# EasyEDA Pro project bldc_driver_board_easyeda_2.eprj, board PCB4
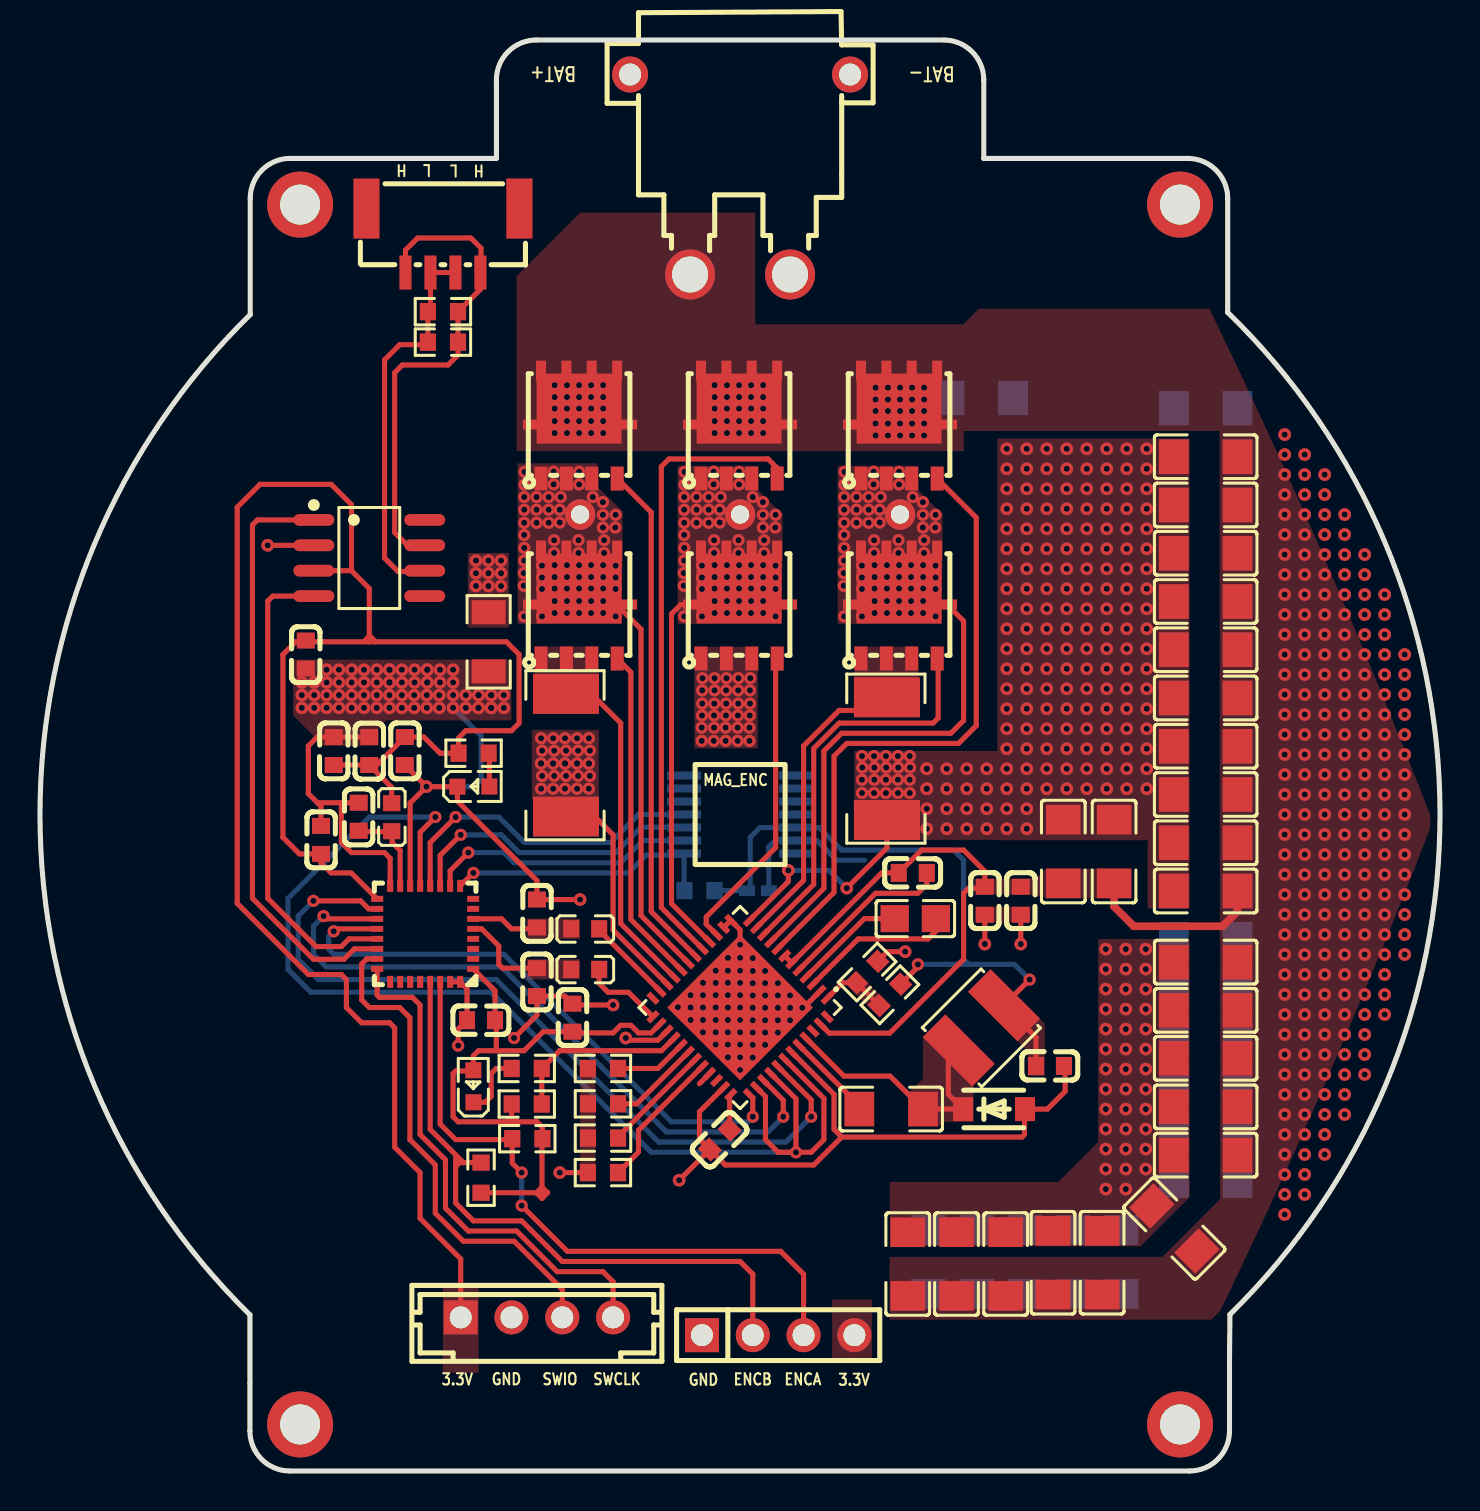
[diagram p1: board, top side]
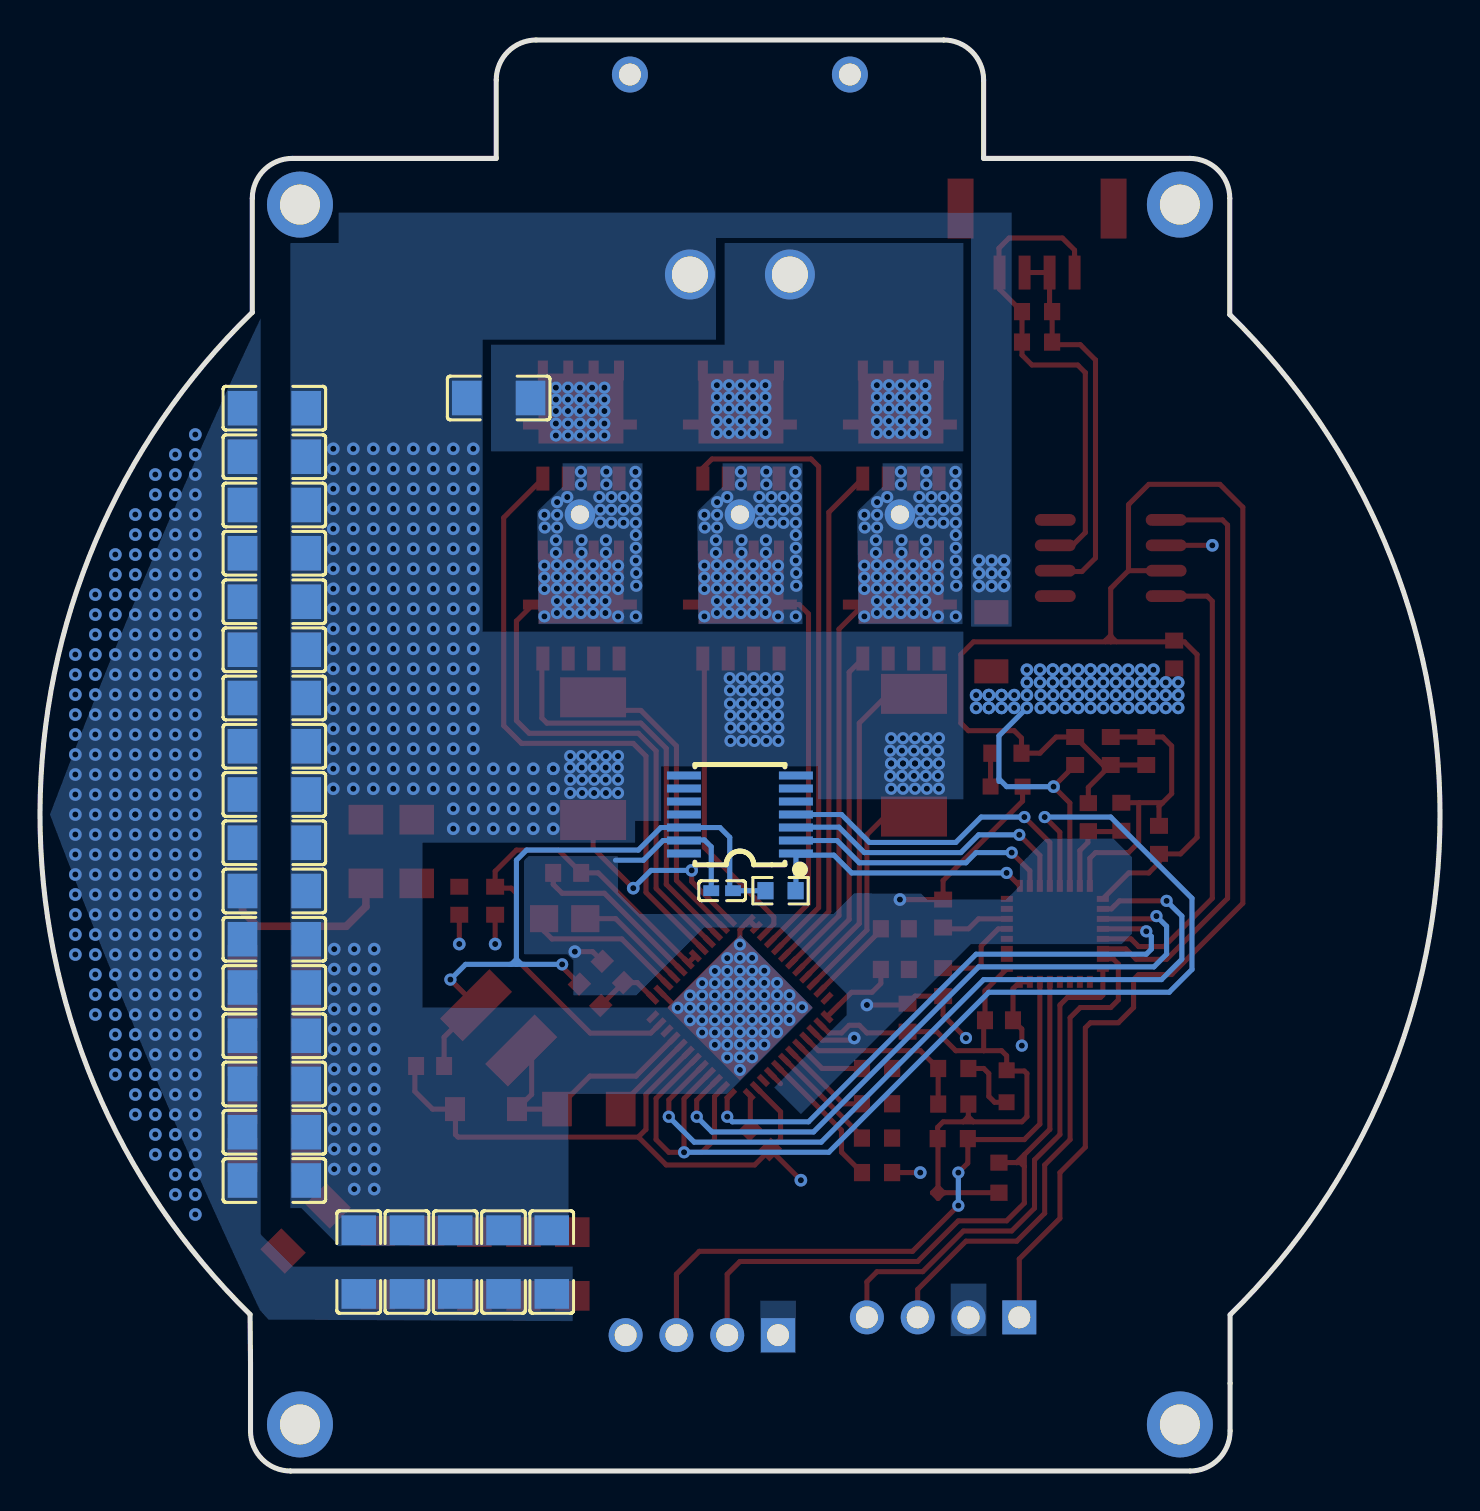
[diagram p2: board, bottom side, seen from below]

Outline 70.01 x 71.56 mm; copper layers: Top Layer, Bottom Layer. Coordinates in mm from the lower left corner of the outline.
Outline path: 10.5,7.81 arc(0,32.82) 10.51,57.83 10.51,63.64 arc(11.1,65.05) 12.51,65.64 22.82,65.64 22.82,69.56 arc(23.41,70.97) 24.82,71.56 45.19,71.56 arc(46.61,70.97) 47.19,69.56 47.19,65.64 57.39,65.64 arc(58.81,65.05) 59.39,63.64 59.39,57.94 arc(70.01,32.91) 59.5,7.83 59.48,5.43 59.48,2 arc(58.9,0.59) 57.48,0 12.5,0 arc(11.08,0.59) 10.5,2 10.5,7.81
Stack: Top Layer 0.035mm / Dielectric1 1.51mm FR4 er 4.5 / Bottom Layer 0.035mm

## Design rules (mm)
template: JLCPCB Capability(Two Layers Board)
spacing copperThickness1oz (default): track to track 0.102, other pairs 0.152 to 0.3
spacing copperThickness2oz: track to track 0.203, other pairs 0.152 to 0.3
track width copperThickness1oz (default): min 0.127, default 0.254, max 2.54
track width copperThickness2oz: min 0.203, default 0.254, max 2.54
differential pair differentialPair (default): width min 0.127, default 0.254, max 2.54; gap min 0.152, default 0.152
via viaSize (default): diameter min 0.5, default 0.61, max 10; hole min 0.3, default 0.305, max 6.3

## Placement (name value [footprint] x y rotation side)
C1  100nF  [C0603]  22.05 22.54 0 top
C2  100nF  [C0603]  14.05 31.56 270 top
C5  47nF  [C0805]  43.77 27.62 0 top
C6  10uF  [C1206]  53.71 30.98 90 top
C7  100nF  [C1206]  51.17 30.98 90 top
C8  1uF  [C0603]  43.64 29.91 0 top
C9  100nF  [C0603]  26.63 22.67 270 top
C10  1uF  [C0603]  33.99 16.57 45 top
C11  100nF  [C1206]  42.56 18.1 180 top
C12  22uF  [C0603]  50.5 20.26 0 top
C13  1uF  [C0603]  47.25 28.52 270 top
C14  1uF  [C0603]  49.04 28.52 270 top
C15  10uF  [C1206]  56.72 12.13 315 top
C16  10uF  [C1206]  58.29 48.31 0 bottom
C17  10uF  [C1206]  47.07 53.66 180 bottom
C18  10uF  [C1206]  46.83 10.45 270 bottom
C19  10uF  [C1206]  51.66 10.45 270 bottom
C20  10uF  [C1206]  43.39 10.35 270 top
C21  10uF  [C1206]  58.29 18.21 0 top
C22  10uF  [C1206]  58.29 50.72 0 top
C23  10uF  [C1206]  58.29 19.35 0 bottom
C24  10uF  [C1206]  58.29 21.77 0 bottom
C25  10uF  [C1206]  58.29 29 0 bottom
C26  10uF  [C1206]  58.29 31.42 0 bottom
C27  10uF  [C1206]  58.29 36.24 0 bottom
C28  10uF  [C1206]  58.29 41.07 0 bottom
C29  10uF  [C1206]  58.29 48.31 0 top
C30  10uF  [C1206]  58.29 43.48 0 top
C31  10uF  [C1206]  58.29 38.66 0 top
C32  10uF  [C1206]  58.29 33.83 0 top
C33  10uF  [C1206]  58.29 29 0 top
C34  10uF  [C1206]  58.29 23.04 0 top
C35  10uF  [C1206]  58.29 45.9 0 bottom
C36  10uF  [C1206]  58.29 50.72 0 bottom
C37  10uF  [C1206]  44.42 10.45 270 bottom
C38  10uF  [C1206]  49.24 10.45 270 bottom
C39  10uF  [C1206]  54.07 10.45 270 bottom
C40  10uF  [C1206]  58.29 53.15 0 bottom
C41  10uF  [C1206]  58.29 15.8 0 top
C42  10uF  [C1206]  58.29 14.53 0 bottom
C43  10uF  [C1206]  58.29 16.94 0 bottom
C44  10uF  [C1206]  58.29 24.18 0 bottom
C45  10uF  [C1206]  58.29 26.59 0 bottom
C46  10uF  [C1206]  58.29 33.83 0 bottom
C47  10uF  [C1206]  58.29 38.66 0 bottom
C48  10uF  [C1206]  58.29 43.47 0 bottom
C49  10uF  [C1206]  58.29 45.9 0 top
C50  10uF  [C1206]  58.29 41.07 0 top
C51  10uF  [C1206]  58.29 36.24 0 top
C52  10uF  [C1206]  58.29 31.42 0 top
C53  10uF  [C1206]  58.29 25.45 0 top
C54  10uF  [C1206]  58.29 20.64 0 top
C55  22uF  [C0603]  13.29 40.83 90 top
C56  220nF  [C0603]  14.69 36 270 top
C57  10nF  [C0603]  24.85 24.45 270 top
C58  10nF  [C0603]  24.85 27.88 270 top
C59  2.2uF  [C0402]  35.9 29.02 180 bottom
C60  10uF  [C1206]  48.29 10.35 270 top
C61  10uF  [C1206]  45.83 10.35 270 top
C62  10uF  [C1206]  53.11 10.41 270 top
C63  10uF  [C1206]  50.66 10.41 270 top
CN1  A1257WR-S-4P  [CONN-SMD_A1257WR-S-4P]  20.15 61.53 180 top
CN2  XT30PW-M  [CONN-TH_XT30PW-M]  35.01 64.83 180 top
D1  MBR1H100SFT3G  [SOD-123F_L2.8-W1.8-LS3.7-RD]  47.71 18.1 0 top
H2  PZ254V-11-04P  [HDR-TH_4P-P2.54-V-M]  36.91 6.79 0 top
L2  100uH  [IND-SMD_L4.0-W4.0]  47.07 22.16 45 top
LED1  LTST-C191KRKT  [LED0603-RD]  21.67 34.23 0 top
LED2  LTST-C191KRKT  [LED0603-RD]  21.67 19.24 90 top
NOREF  -  [Pad_e1307]  57.01 63.33 0 top
NOREF#2  -  [Pad_e127]  35.01 47.83 0 top
NOREF#3  -  [Pad_e1308]  57.01 2.33 0 top
NOREF#4  -  [Pad_e126]  27.01 47.83 0 top
NOREF#5  -  [Pad_e128]  43.01 47.83 0 top
NOREF#6  -  [Pad_e1309]  13.01 2.33 0 top
NOREF#7  -  [Pad_e1306]  13.01 63.33 0 top
R1  10kΩ  [R0603]  32.98 29.02 180 bottom
R4  510Ω  [R0603]  21.68 35.9 180 top
R5  10mΩ  [RES-SMD_L6.4-W3.2-R2512]  42.35 35.62 90 top
R6  10mΩ  [RES-SMD_L6.4-W3.2-R2512]  26.3 35.79 90 top
R7  10kΩ  [R0603]  24.34 18.35 180 top
R8  330Ω  [R0603]  24.34 20.13 180 top
R9  47kΩ  [R0603]  28.15 20.13 180 top
R10  47kΩ  [R0603]  28.15 14.92 180 top
R11  75kΩ  [R0603]  28.15 16.65 180 top
R12  75kΩ  [R0603]  28.15 18.36 180 top
R13  33kΩ  [R0603]  42.5 23.81 225 top
R14  10kΩ  [R0603]  41.36 24.96 45 top
R15  0Ω  [R1206]  22.43 41.47 90 top
R16  120Ω  [R0603]  20.15 57.98 0 top
R17  10kΩ  [R0603]  24.37 16.62 180 top
R18  10kΩ  [R0603]  22.05 14.67 90 top
R19  120Ω  [R0603]  20.15 56.45 0 top
U1  STM32G491KEU6  [UFQFPN-32_L5.0-W5.0-P0.50-TL-1]  19.26 26.86 180 top
U2  DRV8323RHRGZR  [VQFN-48_L7.0-W7.0-P0.50-TL-EP5.1]  35.01 23.18 225 top
U3  TCAN332GDR  [SOIC-8_L4.9-W3.9-P1.27-LS6.0-BL]  16.47 45.66 270 top
U4  TPH2R608NH,L1Q  [POWERVDFN-8_L5.0-W5.0-P1.27-LS6.0-BL]  43.01 52.33 0 top
U5  TPH2R608NH,L1Q  [POWERVDFN-8_L5.0-W5.0-P1.27-LS6.0-BL]  43.01 43.33 0 top
U6  TPH2R608NH,L1Q  [POWERVDFN-8_L5.0-W5.0-P1.27-LS6.0-BL]  35.01 52.33 0 top
U7  TPH2R608NH,L1Q  [POWERVDFN-8_L5.0-W5.0-P1.27-LS6.0-BL]  35.01 43.33 0 top
U8  TPH2R608NH,L1Q  [POWERVDFN-8_L5.0-W5.0-P1.27-LS6.0-BL]  27.01 52.33 0 top
U9  TPH2R608NH,L1Q  [POWERVDFN-8_L5.0-W5.0-P1.27-LS6.0-BL]  27.01 43.33 0 top
U10  100nF  [C0603]  15.94 32.72 90 top
U11  100nF  [C0603]  16.47 36 90 top
U12  100nF  [C0603]  18.24 36 270 top
U13  1uH  [L0603]  17.59 32.7 270 top
U14  1uH  [L0603]  27.26 25.08 180 top
U15  1uH  [L0603]  27.26 27.11 180 top
U18  AS5048A-HTSP-500  [TSSOP-14_L5.0-W4.4-P0.65-LS6.4-BL]  35.01 32.83 90 bottom
U20  B4B-EH-A(LF)(SN)  [CONN-TH_B4B-EH-A-LF-SN]  24.85 7.68 0 top

## Footprints (pads in the part's own frame, mm; a bottom-side part is the same pattern mirrored in y, then rotated)
C0402
  rect 0.79x0.54 smd: 1(-0.545,0) 2(0.545,0)
C0603
  rect 0.8x0.9 smd: 1(-0.7,0) 2(0.7,0)
C0805
  rect 1.41x1.35 smd: 1(-1.03,0) 2(1.03,0)
C1206
  rect 1.485x1.728 smd: 1(-1.593,0) 2(1.593,0)
CONN-SMD_A1257WR-S-4P
  rect 0.6x1.7 smd: 1(1.875,1.6) 2(0.625,1.6) 3(-0.625,1.6) 4(-1.875,1.6)
  rect 1.3x3 smd: 5(3.825,-1.6) 6(-3.825,-1.6)
CONN-TH_B4B-EH-A-LF-SN
  rect 1.7x1.7 hole 1.1: 1(-3.81,0)
  round 1.7 hole 1.1: 2(-1.27,0) 3(1.27,0) 4(3.81,0)
CONN-TH_XT30PW-M
  round 2.5 hole 1.8: 1(-2.5,5) 2(2.5,5)
  round 1.8 hole 1.1: 3(5.5,-5) 4(-5.5,-5)
HDR-TH_4P-P2.54-V-M
  rect 1.7x1.7 hole 1.1: 1(-3.81,0)
  round 1.7 hole 1.1: 2(-1.27,0) 3(1.27,0) 4(3.81,0)
IND-SMD_L4.0-W4.0
  rect 1.6x3.5 smd: 1(-1.6,0) 2(1.6,0)
L0603
  rect 0.8x0.864 smd: 1(-0.7,0) 2(0.7,0)
LED0603-RD
  rect 0.8x0.8 smd: 1(-0.799,-0.004) 2(0.799,0.004)
Pad_e126
  round 1.524 hole 0.914: 50(0,0)
Pad_e127
  round 1.524 hole 0.914: 51(0,0)
Pad_e128
  round 1.524 hole 0.914: 52(0,0)
Pad_e1306
  round 3.3 hole 2: 53(0,0)
Pad_e1307
  round 3.3 hole 2: 54(0,0)
Pad_e1308
  round 3.3 hole 2: 55(0,0)
Pad_e1309
  round 3.3 hole 2: 56(0,0)
POWERVDFN-8_L5.0-W5.0-P1.27-LS6.0-BL
  rect 0.65x1.2 smd: 1(-1.955,-2.7) 2(-0.685,-2.7) 3(0.585,-2.7) 4(1.855,-2.7)
  rect 0.5x1 smd: 5(1.855,2.7) 6(0.585,2.7) 7(-0.685,2.7) 8(-1.955,2.7)
  rect 1x0.5 smd: 8(-2.35,0.001) 8(2.35,0.001)
  rect 4.25x3.5 smd: 8(-0.05,0.8)
R0603
  rect 0.806x0.864 smd: 1(-0.753,0) 2(0.753,0)
R1206
  rect 1.208x1.701 smd: 1(-1.479,0) 2(1.479,0)
RES-SMD_L6.4-W3.2-R2512
  rect 2x3.3 smd: 1(-3.067,0) 2(3.067,0)
SOD-123F_L2.8-W1.8-LS3.7-RD
  rect 1x1.2 smd: 1(-1.55,0) 2(1.55,0)
SOIC-8_L4.9-W3.9-P1.27-LS6.0-BL
  oval 0.588x2.045 smd: 1(-1.905,-2.772) 2(-0.635,-2.772) 3(0.635,-2.772) 4(1.905,-2.772) 5(1.905,2.772) 6(0.635,2.772) 7(-0.635,2.772) 8(-1.905,2.772)
TSSOP-14_L5.0-W4.4-P0.65-LS6.4-BL
  rect 0.4x1.7 smd: 1(-1.95,-2.8) 2(-1.3,-2.8) 3(-0.65,-2.8) 4(0,-2.8) 5(0.65,-2.8) 6(1.3,-2.8) 7(1.95,-2.8) 8(1.95,2.8) 9(1.3,2.8) 10(0.65,2.8) 11(0,2.8) 12(-0.65,2.8) 13(-1.3,2.8) 14(-1.95,2.8)
UFQFPN-32_L5.0-W5.0-P0.50-TL-1
  rect 0.6x0.3 smd: 1(-2.4,1.75) 2(-2.4,1.25) 3(-2.4,0.75) 4(-2.4,0.25) 5(-2.4,-0.25) 6(-2.4,-0.75) 7(-2.4,-1.25) 8(-2.4,-1.75) 17(2.4,-1.75) 18(2.4,-1.25) 19(2.4,-0.75) 20(2.4,-0.25) 21(2.4,0.25) 22(2.4,0.75) 23(2.4,1.25) 24(2.4,1.75)
  rect 0.3x0.6 smd: 9(-1.75,-2.4) 10(-1.25,-2.4) 11(-0.75,-2.4) 12(-0.25,-2.4) 13(0.25,-2.4) 14(0.75,-2.4) 15(1.25,-2.4) 16(1.75,-2.4) 25(1.75,2.4) 26(1.25,2.4) 27(0.75,2.4) 28(0.25,2.4) 29(-0.25,2.4) 30(-0.75,2.4) 31(-1.25,2.4) 32(-1.75,2.4)
VQFN-48_L7.0-W7.0-P0.50-TL-EP5.1
  rect 0.665x0.28 smd: 1(-3.408,2.75) 2(-3.408,2.25) 3(-3.407,1.75) 4(-3.408,1.25) 5(-3.407,0.75) 6(-3.408,0.25) 7(-3.408,-0.25) 8(-3.407,-0.75) 9(-3.408,-1.25) 10(-3.407,-1.75) 11(-3.408,-2.25) 12(-3.408,-2.75) 25(3.408,-2.75) 26(3.408,-2.25) 27(3.407,-1.75) 28(3.408,-1.25) 29(3.407,-0.75) 30(3.408,-0.25) 31(3.408,0.25) 32(3.407,0.75) 33(3.408,1.25) 34(3.407,1.75) 35(3.408,2.25) 36(3.408,2.75)
  rect 0.28x0.665 smd: 13(-2.75,-3.408) 14(-2.25,-3.408) 15(-1.75,-3.407) 16(-1.25,-3.408) 17(-0.75,-3.407) 18(-0.25,-3.408) 19(0.25,-3.408) 20(0.75,-3.407) 21(1.25,-3.408) 22(1.75,-3.407) 23(2.25,-3.408) 24(2.75,-3.408) 37(2.75,3.408) 38(2.25,3.408) 39(1.75,3.407) 40(1.25,3.408) 41(0.75,3.407) 42(0.25,3.408) 43(-0.25,3.408) 44(-0.75,3.407) 45(-1.25,3.408) 46(-1.75,3.407) 47(-2.25,3.408) 48(-2.75,3.408)
  rect 5.15x5.15 smd: 49(0,0)

## Nets
As in the schematic, except:
BAT-: C6.2 C7.2 C15.1 C16.1 C17.1 C18.1 C19.1 C20.1 C21.1 C22.1 C23.1 C24.1 C25.1 C26.1 C27.1 C28.1 C29.1 C30.1 C31.1 C32.1 C33.1 C34.1 C35.1 C36.1 C37.1 C38.1 C39.1 C40.1 C41.1 C42.1 C43.1 C44.1 C45.1 C46.1 C47.1 C48.1 C49.1 C50.1 C51.1 C52.1 C53.1 C54.1 C60.1 C61.1 C62.1 C63.1 CN2.1 R5.1 R6.1 R15.2 U2.2 U2.12 U2.13 U2.14 U2.22 U2.49 U7.1 U7.2 U7.3
PHASEA: NOREF#5.52 U2.9 U4.1 U4.2 U4.3 U5.5 U5.6 U5.7 U5.8
PHASEB: NOREF#2.51 U2.16 U6.1 U6.2 U6.3 U7.5 U7.6 U7.7 U7.8
PHASEC: NOREF#4.50 U2.19 U8.1 U8.2 U8.3 U9.5 U9.6 U9.7 U9.8

Pads without a net: CN1 5 6; CN2 3 4; NOREF 54; NOREF#3 55; NOREF#6 56; NOREF#7 53; U1 2 3 4 7 8 25 27 28; U2 46 48; U3 5 8; U18 5 6 7 8 9 10 11 14

## Via types
v1: diameter 0.634, hole 0.305, Top Layer to Bottom Layer, 501 vias
v2: diameter 0.61, hole 0.305, Top Layer to Bottom Layer, 428 vias
v3: diameter 0.61, hole 0.3, Top Layer to Bottom Layer, 13 vias

## Routing (per net, layer and track width the routed paths; a pad name or vN(x,y) marks a point on that pad's centre or on a via; arc(x,y) is an arc through that point)
3.3V: length 176.8
  Top Layer w0.254: 16.19,41.47 16.47,41.74 16.47,41.78 16.73,41.53 16.73,41.47 ; 23.59,17.72 23.84,17.46 23.87,17.46 ; 23.59,17.72 R7.2 ; 23.59,17.72 23.33,17.46 ; 24.77,13.91 24.82,13.91 ; 24.82,13.91 25.1,14.19 25.38,13.92 ; 24.82,13.91 25.1,13.64 25.1,13.64 25.38,13.92 ; 25.38,13.92 25.38,13.91 ; 16.46,41.47 16.47,41.47 16.47,44.13 15.58,45.02 ; 16.46,41.47 12.78,41.47 12.15,40.83 12.15,31.69 12.97,30.86 C2.2 14.05,30.42 14.56,29.91 15.56,29.91 U1.17 ; 16.46,41.47 23.32,41.47 23.96,40.83 23.96,37.4 23.58,37.02 21.29,37.02 20.93,36.66 R4.2 20,35.9 19.19,36.7 U12.1 16.84,35.3 U11.1 ; 22.82,21.02 21.92,21.02 21.67,20.76 LED2.2 21.63,20 20.78,20 20.66,19.88 20.66,17.72 20.91,17.46 23.33,17.46 ; 22.82,21.02 22.82,22.48 C1.2 22.75,24.02 U1.1 ; 22.82,21.02 24.21,21.02 25.16,21.97 C9.2 26.69,21.91 28.66,21.91 29.04,22.29 29.55,22.29 29.93,21.91 30.56,21.91 U2.26 ; R13.1 43.9,25.21 v2(43.9,25.34) ; 15.58,45.02 15.58,48.32 14.56,49.34 11,49.34 9.86,48.2 9.86,28.38 13.42,24.83 15.07,24.83 15.32,24.57 15.32,23.18 16.08,22.42 17.48,22.42 17.74,22.16 17.74,16.19 19.01,14.92 19.01,12.64 21.04,10.6 U20.1 ; 15.58,45.02 U3.3 ; C56.2 U11.1 ; U11.1 17.59,34.18 U13.1 ; R18.1 25.1,13.91 25.1,16.6 R17.1 25.12,17.19 24.85,17.46 23.33,17.46 ; 33.48,19.88 33.48,19.87 32.98,19.37 ; v2(49.49,24.57) L2.2 49.8,21.69 C12.1
  Bottom Layer w0.254: 45.82,25.34 45.93,25.34 46.18,25.59 46.44,25.34 46.53,25.34 ; U18.12 37.82,32.19 ; U18.12 36.01,32.18 35.52,31.69 35.52,29.18 C59.2 R1.1 ; U18.12 38.96,32.18 40.09,31.05 45.68,31.05 46.18,30.54 46.18,25.34 46.18,25.34 ; v2(49.49,24.57) 48.72,25.34 46.18,25.34 ; 46.18,25.34 v2(43.9,25.34)
3.3VA: length 4.6
  Top Layer w0.254: 17.61,31.97 17.61,31.43 18.01,31.03 U1.15 ; 17.61,31.97 15.98,31.97 U10.1 ; 17.61,31.97 U13.2
24V: length 36.2
  Top Layer w0.254: U2.47 39.47,21.9 42.49,21.9 46.18,25.59 46.18,28.89 46.44,29.15 47.18,29.15 C13.1 47.25,29.99 46.18,31.05 44.09,31.05 C8.1 42.09,29.91 U2.6 U2.7
  Top Layer w0.381: C33.2 59.88,27.98 59.14,27.24 54.69,27.24 53.71,28.22 C6.1
  vias: v1(62.24,51.83) v1(62.24,50.83) v1(62.24,49.83) v1(62.24,48.83) v1(62.24,47.83) v1(62.24,46.83) v1(62.24,45.83) v1(62.24,44.83) v1(62.24,43.83) v1(62.24,42.83) v1(62.24,41.83) v1(62.24,40.83) v1(62.24,39.83) v1(62.24,38.83) v1(62.24,37.83) v1(62.24,36.83) v1(62.24,35.83) v1(62.24,34.83) v1(62.24,33.83) v1(62.24,32.83) v1(62.24,31.83) v1(62.24,30.83) v1(62.24,29.83) v1(62.24,28.83) v1(62.24,27.83) v1(62.24,26.83) v1(62.24,25.83) v1(62.24,24.83) v1(62.24,23.83) v1(62.24,22.83) v1(62.24,21.83) v1(62.24,20.83) v1(62.24,19.83) v1(62.24,18.83) v1(62.24,17.83) v1(62.24,16.83) v1(62.24,15.83) v1(62.24,14.83) v1(62.24,13.83) v1(62.24,12.83) v1(63.24,50.83) v1(63.24,49.83) v1(63.24,48.83) v1(63.24,47.83) v1(63.24,46.83) v1(63.24,45.83) v1(63.24,44.83) v1(63.24,43.83) v1(63.24,42.83) v1(63.24,41.83) v1(63.24,40.83) v1(63.24,39.83) v1(63.24,38.83) v1(63.24,37.83) v1(63.24,36.83) v1(63.24,35.83) v1(63.24,34.83) v1(63.24,33.83) v1(63.24,32.83) v1(63.24,31.83) v1(63.24,30.83) v1(63.24,29.83) v1(63.24,28.83) v1(63.24,27.83) v1(63.24,26.83) v1(63.24,25.83) v1(63.24,24.83) v1(63.24,23.83) v1(63.24,22.83) v1(63.24,21.83) v1(63.24,20.83) v1(63.24,19.83) v1(63.24,18.83) v1(63.24,17.83) v1(63.24,16.83) v1(63.24,15.83) v1(63.24,14.83) v1(63.24,13.83) v1(64.24,49.83) v1(64.24,48.83) v1(64.24,47.83) v1(64.24,46.83) v1(64.24,45.83) v1(64.24,44.83) v1(64.24,43.83) v1(64.24,42.83) v1(64.24,41.83) v1(64.24,40.83) v1(64.24,39.83) v1(64.24,38.83) v1(64.24,37.83) v1(64.24,36.83) v1(64.24,35.83) v1(64.24,34.83) v1(64.24,33.83) v1(64.24,32.83) v1(64.24,31.83) v1(64.24,30.83) v1(64.24,29.83) v1(64.24,28.83) v1(64.24,27.83) v1(64.24,26.83) v1(64.24,25.83) v1(64.24,24.83) v1(64.24,23.83) v1(64.24,22.83) v1(64.24,21.83) v1(64.24,20.83) v1(64.24,19.83) v1(64.24,18.83) v1(64.24,17.83) v1(64.24,16.83) v1(64.24,15.83) v1(65.24,47.83) v1(65.24,46.83) v1(65.24,45.83) v1(65.24,44.83) v1(65.24,43.83) v1(65.24,42.83) v1(65.24,41.83) v1(65.24,40.83) v1(65.24,39.83) v1(65.24,38.83) v1(65.24,37.83) v1(65.24,36.83) v1(65.24,35.83) v1(65.24,34.83) v1(65.24,33.83) v1(65.24,32.83) v1(65.24,32.83) v1(65.24,31.83) v1(65.24,30.83) v1(65.24,29.83) v1(65.24,28.83) v1(65.24,27.83) v1(65.24,26.83) v1(65.24,25.83) v1(65.24,24.83) v1(65.24,23.83) v1(65.24,22.83) v1(65.24,21.83) v1(65.24,20.83) v1(65.24,19.83) v1(65.24,18.83) v1(65.24,17.83) v1(66.24,45.83) v1(66.24,44.83) v1(66.24,43.83) v1(66.24,42.83) v1(66.24,41.83) v1(66.24,40.83) v1(66.24,39.83) v1(66.24,38.83) v1(66.24,37.83) v1(66.24,36.83) v1(66.24,35.83) v1(66.24,34.83) v1(66.24,33.83) v1(66.24,32.83) v1(66.24,31.83) v1(66.24,30.83) v1(66.24,29.83) v1(66.24,28.83) v1(66.24,27.83) v1(66.24,26.83) v1(66.24,25.83) v1(66.24,24.83) v1(66.24,23.83) v1(66.24,22.83) v1(66.24,21.83) v1(66.24,20.83) v1(66.24,19.83) v1(67.24,43.83) v1(67.24,42.83) v1(67.24,41.83) v1(67.24,40.83) v1(67.24,39.83) v1(67.24,38.83) v1(67.24,37.83) v1(67.24,36.83) v1(67.24,35.83) v1(67.24,34.83) v1(67.24,33.83) v1(67.24,32.83) v1(67.24,31.83) v1(67.24,30.83) v1(67.24,29.83) v1(67.24,28.83) v1(67.24,27.83) v1(67.24,26.83) v1(67.24,25.83) v1(67.24,24.83) v1(67.24,23.83) v1(67.24,22.83) v1(68.24,40.83) v1(68.24,39.83) v1(68.24,38.83) v1(68.24,37.83) v1(68.24,36.83) v1(68.24,35.83) v1(68.24,34.83) v1(68.24,33.83) v1(68.24,32.83) v1(68.24,31.83) v1(68.24,30.83) v1(68.24,29.83) v1(68.24,28.83) v1(68.24,27.83) v1(68.24,26.83) v1(68.24,25.83) v2(25.73,54.3) v2(25.73,53.7) v2(25.73,53.13) v2(25.73,52.5) v2(25.73,51.9) v2(26.35,54.3) v2(26.35,53.7) v2(26.35,53.13) v2(26.35,52.5) v2(26.35,51.9) v2(26.96,54.3) v2(26.96,53.7) v2(26.96,53.13) v2(26.96,52.5) v2(26.96,51.9) v2(27.56,54.3) v2(27.56,53.7) v2(27.56,53.13) v2(27.56,52.5) v2(27.56,51.9) v2(28.16,54.3) v2(28.16,53.7) v2(28.16,53.13) v2(28.16,52.5) v2(28.16,51.9) v2(33.73,54.3) v2(33.73,53.7) v2(33.73,53.13) v2(33.73,52.5) v2(33.73,51.9) v2(34.35,54.3) v2(34.35,53.7) v2(34.35,53.13) v2(34.35,52.5) v2(34.35,51.9) v2(34.96,54.3) v2(34.96,53.7) v2(34.96,53.13) v2(34.96,52.5) v2(34.96,51.9) v2(35.56,54.3) v2(35.56,53.7) v2(35.56,53.13) v2(35.56,52.5) v2(35.56,51.9) v2(36.16,54.3) v2(36.16,53.7) v2(36.16,53.13) v2(36.16,52.5) v2(36.16,51.9) v2(41.78,54.18) v2(41.78,53.58) v2(41.78,53.01) v2(41.78,52.38) v2(41.78,51.78) v2(42.4,54.18) v2(42.4,53.58) v2(42.4,53.01) v2(42.4,52.38) v2(42.4,51.78) v2(43.01,54.18) v2(43.01,53.58) v2(43.01,53.01) v2(43.01,52.38) v2(43.01,51.78) v2(43.61,54.18) v2(43.61,53.58) v2(43.61,53.01) v2(43.61,52.38) v2(43.61,51.78) v2(44.21,54.18) v2(44.21,53.58) v2(44.21,53.01) v2(44.21,52.38) v2(44.21,51.78)
DVDD: length 1.8
  Top Layer w0.254: U2.36 34.49,18.77 34.49,17.07
GND: length 102.2
  Top Layer w0.254: R10.2 v1(25.99,14.92) ; U2.35 32.98,17.96 32.98,16.6 33.5,16.08 ; U1.31 U1.32 21.35,24.12 C1.1 20.91,22.1 v2(20.91,21.27) ; v1(27.01,28.58) C58.1 24.85,29.53 20.87,33.5 LED1.1 v1(19.33,34.22) ; v1(19.33,34.22) 18.51,33.41 U1.14 ; v1(19.33,34.22) U12.2 ; R14.2 42.37,25.97 v1(43.26,25.97) ; 40.09,16.7 49.1,16.7 49.23,16.83 49.23,18.07 D1.2 50.37,18.1 51.26,18.99 51.26,20.19 C12.2 ; 40.09,16.7 38.69,15.3 34.27,15.3 33.5,16.08 ; 40.09,16.7 39.71,17.08 39.71,18.83 U2.43 ; 15.03,33.42 13.87,33.42 ; 15.03,33.42 15.07,33.37 15.07,31.43 15.58,30.92 17.23,30.92 17.51,30.64 U1.16 ; 15.03,33.42 U10.2 ; 13.87,33.42 14.05,33.24 C2.1 ; 13.87,33.42 13.42,33.87 13.42,36.26 13.86,36.7 C56.1 U11.2 ; 33.5,16.08 v1(31.96,14.54) ; v2(23.7,21.65) 24.85,22.8 C57.2 26.25,23.75 C9.1 26.69,23.3 v1(28.66,23.3) ; C14.2 v1(49.04,26.35) ; U3.2 v1(11.39,46.29) ; 31.36,22.01 30.9,21.54 29.4,21.54 v1(29.29,21.65) ; C13.2 v1(47.25,26.35)
  Bottom Layer w0.254: 22.05,34.61 22.05,36.77 v1(20.66,38.16) ; 22.05,34.61 22.05,34.48 ; 22.05,34.61 21.67,34.22 v1(19.33,34.22) ; C59.1 36.44,31.22 36.79,31.56 37.78,31.56 U18.13 38.85,31.53 39.83,30.54 41.23,30.54
  vias: v1(13.09,39.43) v1(13.09,38.8) v1(13.09,38.16) v1(13.71,39.43) v1(13.71,38.8) v1(13.71,38.16) v1(14.33,40.07) v1(14.33,39.43) v1(14.33,38.8) v1(14.33,38.16) v1(14.95,40.07) v1(14.95,39.43) v1(14.95,38.8) v1(14.95,38.16) v1(15.58,40.07) v1(15.58,39.43) v1(15.58,38.8) v1(15.58,38.16) v1(16.2,40.07) v1(16.2,39.43) v1(16.2,38.8) v1(16.2,38.16) v1(16.84,40.07) v1(16.84,39.43) v1(16.84,38.8) v1(16.84,38.16) v1(17.48,40.07) v1(17.48,40.07) v1(17.48,39.43) v1(17.48,39.43) v1(17.48,38.8) v1(17.48,38.16) v1(18.09,40.07) v1(18.09,39.43) v1(18.09,38.8) v1(18.09,38.16) v1(18.73,40.07) v1(18.73,39.43) v1(18.71,38.8) v1(18.71,38.16) v1(19.34,38.8) v1(19.34,38.16) v1(19.37,40.07) v1(19.37,40.07) v1(19.37,39.43) v1(19.37,39.43) v1(20,40.07) v1(20,39.43) v1(19.97,38.8) v1(19.97,38.16) v1(20.66,40.07) v1(20.66,39.43) v1(20.66,38.8) v1(21.29,38.8) v1(21.29,38.16) v1(21.93,38.8) v1(21.93,38.8) v1(21.93,38.16) v1(21.93,38.16) v1(22.56,38.8) v1(22.56,38.8) v1(22.56,38.16) v1(22.56,38.16) v1(23.2,38.8) v1(23.2,38.16)
BAT-: length 30.8
  Top Layer w0.254: 38.13,23.18 38.19,23.18 38.93,23.92 ; v1(40.34,29.15) 42.35,31.15 R5.1 ; R6.1 27.74,32.73 28.66,31.81 28.66,27.05 31.36,24.35 ; U2.12 37.42,29.48 v1(37.42,30.04) ; U2.14 U2.13 35.01,27.07 v3(35.01,26.32) v3(35.01,25.66) v3(35.01,25.02) v3(35.01,24.41) v3(35.01,23.8) v3(35.01,23.18) v2(34.4,23.18) v2(33.79,23.18) v2(33.15,23.18) v2(32.53,23.18)
  Bottom Layer w0.254: v1(37.42,30.04) 39.45,30.04 v1(40.34,29.15)
  vias: v1(21.8,45.53) v1(21.8,44.89) v1(21.8,44.26) v1(22.42,45.53) v1(22.42,44.89) v1(22.42,44.25) v1(23.05,45.53) v1(23.05,44.89) v1(23.05,44.25) v1(44.34,35.12) v1(44.34,35.12) v1(44.34,34.12) v1(44.34,34.12) v1(44.34,33.12) v1(44.34,32.12) v1(45.34,35.12) v1(45.34,34.12) v1(45.34,33.12) v1(45.34,32.12) v1(46.34,35.12) v1(46.34,34.12) v1(46.34,33.12) v1(46.34,32.12) v1(47.34,35.12) v1(47.34,34.12) v1(47.34,33.12) v1(47.34,32.12) v1(48.34,51.12) v1(48.34,50.12) v1(48.34,49.12) v1(48.34,48.12) v1(48.34,47.12) v1(48.34,46.12) v1(48.34,45.12) v1(48.34,44.12) v1(48.34,43.12) v1(48.34,42.12) v1(48.34,41.12) v1(48.34,40.12) v1(48.34,39.12) v1(48.34,38.12) v1(48.34,37.12) v1(48.34,36.12) v1(48.34,35.12) v1(48.34,34.12) v1(48.34,33.12) v1(48.34,32.12) v1(49.34,51.12) v1(49.34,50.12) v1(49.34,49.12) v1(49.34,48.12) v1(49.34,47.12) v1(49.34,46.12) v1(49.34,45.12) v1(49.34,44.12) v1(49.34,43.12) v1(49.34,42.12) v1(49.34,41.12) v1(49.34,40.12) v1(49.34,39.12) v1(49.34,38.12) v1(49.34,37.12) v1(49.34,36.12) v1(49.34,35.12) v1(49.34,34.12) v1(49.34,33.12) v1(49.34,32.12) v1(50.34,51.12) v1(50.34,50.12) v1(50.34,49.12) v1(50.34,48.12) v1(50.34,47.12) v1(50.34,46.12) v1(50.34,45.12) v1(50.34,44.12) v1(50.34,43.12) v1(50.34,42.12) v1(50.34,41.12) v1(50.34,40.12) v1(50.34,39.12) v1(50.34,38.12) v1(50.34,37.12) v1(50.34,36.12) v1(50.34,35.12) v1(50.34,34.12) v1(51.34,51.12) v1(51.34,50.12) v1(51.34,49.12) v1(51.34,48.12) v1(51.34,47.12) v1(51.34,46.12) v1(51.34,45.12) v1(51.34,44.12) v1(51.34,43.12) v1(51.34,42.12) v1(51.34,41.12) v1(51.34,40.12) v1(51.34,39.12) v1(51.34,38.12) v1(51.34,37.12) v1(51.34,36.12) v1(51.34,35.12) v1(51.34,34.12) v1(52.34,51.12) v1(52.34,50.12) v1(52.34,49.12) v1(52.34,48.12) v1(52.34,47.12) v1(52.34,46.12) v1(52.34,45.12) v1(52.34,44.12) v1(52.34,43.12) v1(52.34,42.12) v1(52.34,41.12) v1(52.34,40.12) v1(52.34,39.12) v1(52.34,38.12) v1(52.34,37.12) v1(52.34,36.12) v1(52.34,35.12) v1(52.34,34.12) v1(53.34,51.12) v1(53.34,50.12) v1(53.34,49.12) v1(53.34,48.12) v1(53.34,47.12) v1(53.34,46.12) v1(53.34,45.12) v1(53.34,44.12) v1(53.34,43.12) v1(53.34,42.12) v1(53.34,41.12) v1(53.34,40.12) v1(53.34,39.12) v1(53.34,38.12) v1(53.34,37.12) v1(53.34,36.12) v1(53.34,35.12) v1(53.34,34.12) v1(53.3,26.1) v1(53.3,25.1) v1(53.3,24.1) v1(53.3,23.1) v1(53.3,22.1) v1(53.3,21.1) v1(53.3,20.1) v1(53.3,19.1) v1(53.3,18.1) v1(53.3,17.1) v1(53.3,16.1) v1(53.3,15.1) v1(53.3,14.1) v1(54.34,51.12) v1(54.34,50.12) v1(54.34,49.12) v1(54.34,48.12) v1(54.34,47.12) v1(54.34,46.12) v1(54.34,45.12) v1(54.34,44.12) v1(54.34,43.12) v1(54.34,42.12) v1(54.34,41.12) v1(54.34,40.12) v1(54.34,39.12) v1(54.34,38.12) v1(54.34,37.12) v1(54.34,36.12) v1(54.34,35.12) v1(54.34,34.12) v1(54.3,26.1) v1(54.3,25.1) v1(54.3,24.1) v1(54.3,23.1) v1(54.3,22.1) v1(54.3,21.1) v1(54.3,20.1) v1(54.3,19.1) v1(54.3,18.1) v1(54.3,17.1) v1(54.3,16.1) v1(54.3,15.1) v1(54.3,14.1) v1(55.34,51.12) v1(55.34,50.12) v1(55.34,49.12) v1(55.34,48.12) v1(55.34,47.12) v1(55.34,46.12) v1(55.34,45.12) v1(55.34,44.12) v1(55.34,43.12) v1(55.34,42.12) v1(55.34,41.12) v1(55.34,40.12) v1(55.34,39.12) v1(55.34,38.12) v1(55.34,37.12) v1(55.34,36.12) v1(55.34,35.12) v1(55.34,34.12) v1(55.3,26.1) v1(55.3,25.1) v1(55.3,24.1) v1(55.3,23.1) v1(55.3,22.1) v1(55.3,21.1) v1(55.3,20.1) v1(55.3,19.1) v1(55.3,18.1) v1(55.3,17.1) v1(55.3,16.1) v1(55.3,15.1) v2(25.06,36.64) v2(25.06,35.38) v2(25.06,35.38) v2(25.06,34.12) v2(25.11,36.02) v2(25.11,34.76) v2(25.66,36.64) v2(25.71,36.02) v2(25.66,35.38) v2(25.66,35.38) v2(25.71,34.76) v2(25.66,34.12) v2(26.25,36.64) v2(26.25,35.38) v2(26.25,35.38) v2(26.25,34.12) v2(26.3,36.02) v2(26.3,34.76) v2(26.85,36.64) v2(26.85,35.38) v2(26.85,35.38) v2(26.85,34.12) v2(26.91,36.02) v2(26.91,34.76) v2(27.45,36.64) v2(27.45,35.38) v2(27.45,35.38) v2(27.45,34.12) v2(27.5,36.02) v2(27.5,34.76) v2(32.53,23.8) v2(32.53,22.55) v2(33.13,39.65) v2(33.11,39.04) v2(33.11,38.38) v2(33.1,37.78) v2(33.09,37.17) v2(33.09,36.51) v2(33.15,24.41) v2(33.15,23.8) v2(33.15,22.55) v2(33.15,21.94) v2(33.73,39.65) v2(33.73,39.04) v2(33.72,38.38) v2(33.71,37.78) v2(33.71,37.17) v2(33.69,36.51) v2(33.79,25.02) v2(33.79,24.41) v2(33.79,23.8) v2(33.79,22.55) v2(33.79,21.94) v2(33.79,21.33) v2(34.32,39.65) v2(34.31,39.04) v2(34.31,38.38) v2(34.3,37.78) v2(34.28,37.17) v2(34.29,36.51) v2(34.4,25.66) v2(34.4,25.02) v2(34.4,24.41) v2(34.4,23.8) v2(34.4,22.55) v2(34.4,21.94) v2(34.4,21.33) v2(34.4,20.69) v2(34.93,39.65) v2(34.91,39.04) v2(34.91,38.38) v2(34.9,37.78) v2(34.89,37.17) v2(34.89,36.51) v2(35.52,39.65) v2(35.5,39.04) v2(35.5,38.38) v2(35.49,37.78) v2(35.48,37.17) v2(35.48,36.51) v2(35.64,25.65) v2(35.64,25.01) v2(35.64,24.4) v2(35.64,23.78) v2(35.64,23.16) v2(35.64,22.54) v2(35.64,21.93) v2(35.64,21.31) v2(35.64,20.67) v2(36.26,25.01) v2(36.26,24.4) v2(36.26,23.78) v2(36.26,23.16) v2(36.26,22.54) v2(36.26,21.93) v2(36.26,21.31) v2(36.9,24.4) v2(36.9,23.78) v2(36.9,23.16) v2(36.9,22.54) v2(36.9,21.93) v2(37.51,23.78) v2(37.51,23.16) v2(37.51,22.54) v2(41.1,35.75) v2(41.12,35.18) v2(41.1,34.57) v2(41.1,33.9) v2(41.71,35.75) v2(41.72,35.18) v2(41.72,34.57) v2(41.71,33.9) v2(42.3,35.75) v2(42.31,35.18) v2(42.3,34.57) v2(42.3,33.9) v2(42.9,35.75) v2(42.92,35.18) v2(42.9,34.57) v2(42.9,33.9) v2(43.49,35.75) v2(43.51,35.18) v2(43.49,34.57) v2(43.49,33.9) v3(31.9,23.19) v3(35.01,22.55) v3(35.01,21.94) v3(35.01,21.33) v3(35.01,20.69) v3(35.01,20.06) v3(38.12,23.16)
CANH: length 24.5
  Top Layer w0.254: CN1.1 18.27,61.05 18.88,61.66 21.55,61.66 22.05,61.15 22.05,59.96 CN1.4 22.02,59.1 R16.2 R19.2 20.9,55.81 20.4,55.31 18.12,55.31 17.74,54.93 17.74,46.93 18.37,46.29 19.24,46.29
CANL: length 19.5
  Top Layer w0.254: 19.24,44.98 17.9,44.98 17.23,45.66 17.23,55.56 17.99,56.32 19.27,56.32 R19.1 R16.1 19.52,58.1 CN1.2 CN1.3
CLK_MAG: length 13.5
  Top Layer w0.254: v2(21.42,30.92) 20.51,30.02 U1.10
  Bottom Layer w0.254: U18.2 30.15,31.53 29.04,30.42 23.7,30.42 23.2,30.92 v2(21.42,30.92)
CS_MAG: length 13.6
  Top Layer w0.254: U1.9 21.66,29.91 v2(21.67,29.91)
  Bottom Layer w0.254: v2(21.67,29.91) 29.42,29.91 30.31,30.8 32.13,30.8 U18.1 32.21,29.16
ENABLE: length 61.1
  Top Layer w0.254: v2(37.8,15.94) 37.8,18.62 36.53,19.88 ; v2(37.8,15.94) 38.56,15.94 39.2,16.57 39.2,18.63 U2.42 ; v2(37.8,15.94) 36.91,15.94 36.28,16.57 36.28,18.73 U2.38 ; U1.13 19.01,31.94 v2(19.77,32.7)
  Bottom Layer w0.254: v2(19.77,32.7) 16.47,32.7 12.4,28.64 12.4,25.08 13.54,23.94 22.56,23.94 30.56,15.94 v2(37.8,15.94)
ENC_A: length 33.2
  Top Layer w0.254: H2.3 38.18,9.84 37.04,10.99 26.37,10.99 v2(24.09,13.27) ; v2(24.09,14.92) 23.61,15.39 R17.2 23.57,16.57 20.78,16.57 20.01,17.35 U1.30
  Bottom Layer w0.254: v2(24.09,14.92) v2(24.09,13.27)
ENC_B: length 32.9
  Top Layer w0.254: 20.78,15.22 20.98,15.42 21.17,15.42 ; 21.17,15.42 20.79,15.81 ; 21.17,15.42 R18.2 ; H2.2 35.64,9.84 35.01,10.48 26.12,10.48 24.09,12.51 21.67,12.51 20.78,13.4 20.78,15.8 20.79,15.81 ; 20.79,15.81 19.51,17.09 U1.29
FB: length 3.4
  Top Layer w0.254: R13.2 R14.1 40.14,24.42 U2.1
FDCAN_RX: length 23.4
  Top Layer w0.254: 13.19,43.75 11.64,43.75 11.39,43.5 11.39,28.64 13.8,26.23 15.07,26.23 15.45,26.61 U1.21
FDCAN_TX: length 28.8
  Top Layer w0.254: 12.93,47.56 10.88,47.56 10.62,47.31 10.62,28.64 13.67,25.59 15.2,25.59 15.72,26.11 U1.22
GHA: length 31.7
  Top Layer w0.254: U4.4 46.82,47.67 46.82,37.27 45.93,36.39 40.34,36.39 39.71,35.75 39.71,28.94 U2.8
GHB: length 31.6
  Top Layer w0.254: U6.4 36.86,50.15 36.4,50.61 31.45,50.61 31.07,50.23 31.07,28.17 U2.17
GHC: length 25.5
  Top Layer w0.254: U2.18 30.56,27.98 30.56,47.94 28.88,49.63 U8.4
GLA: length 20.2
  Top Layer w0.254: 36.18,26.82 38.69,29.34 38.69,36.13 39.96,37.4 44.66,37.4 44.91,37.66 44.91,40.58 U5.4
GLB: length 15.5
  Top Layer w0.254: U7.4 36.79,40.55 36.79,31.18 33.31,27.71 33.31,27.35 33.84,26.82
GLC: length 16.9
  Top Layer w0.254: U9.4 29.55,39.95 29.55,27.58 U2.20
LP_SOA: length 4.5
  Top Layer w0.254: C57.1 23.13,25.15 22.94,25.34 22.94,26.25 22.09,27.11 U1.5
LP_SOC: length 3.5
  Top Layer w0.254: U1.6 23.08,27.61 23.58,27.11 24.79,27.11 C58.2 24.91,27.11
MISO_MAG: length 15
  Top Layer w0.254: v2(21.04,31.81) 20.01,30.79 U1.11
  Bottom Layer w0.254: v2(21.04,31.81) 23.07,31.81 23.96,30.92 28.78,30.92 30.05,32.19 32.19,32.19 U18.3
MOSI_MAG: length 16.5
  Top Layer w0.254: v2(20.78,32.7) 19.51,31.43 U1.12
  Bottom Layer w0.254: v2(20.78,32.7) 22.94,32.7 24.21,31.43 28.53,31.43 29.93,32.83 U18.4
NFAULT: length 9
  Top Layer w0.254: R7.1 R8.1 25.98,21.02 31.08,21.02 31.71,21.65
PHASEA: length 24.4
  Top Layer w0.254: 36.53,26.47 39.2,29.14 39.2,36 40.09,36.89 45.55,36.89 46.18,37.53 46.18,42.5 U5.8
  vias: v2(40.23,49.96) v2(40.23,49.33) v2(40.21,48.7) v2(40.21,48.07) v2(40.21,47.42) v2(40.21,46.81) v2(40.21,46.16) v2(40.21,45.53) v2(40.19,44.9) v2(40.19,44.27) v2(40.21,42.74) v2(40.83,48.7) v2(40.83,48.07) v2(40.83,47.42) v2(41.1,45.28) v2(41.1,44.68) v2(41.1,44.11) v2(41.1,42.74) v2(41.44,48.7) v2(41.44,48.07) v2(41.44,47.42) v2(41.69,49.97) v2(41.69,49.34) v2(41.71,46.55) v2(41.71,45.91) v2(41.73,45.3) v2(41.73,44.7) v2(41.73,44.13) v2(41.73,43.5) v2(41.73,42.9) v2(42.04,48.7) v2(41.99,48.07) v2(41.99,47.43) v2(42.35,45.3) v2(42.35,44.7) v2(42.35,44.13) v2(42.35,43.5) v2(42.35,42.9) v2(42.96,49.97) v2(42.96,49.33) v2(42.93,46.55) v2(42.93,45.91) v2(42.96,45.3) v2(42.96,44.7) v2(42.96,44.13) v2(42.96,43.5) v2(42.96,42.9) v2(43.64,48.7) v2(43.56,45.3) v2(43.56,44.7) v2(43.56,44.13) v2(43.56,43.5) v2(43.56,42.9) v2(44.15,48.45) v2(44.15,47.82) v2(44.15,47.18) v2(44.21,46.55) v2(44.21,45.91) v2(44.16,45.3) v2(44.16,44.7) v2(44.16,44.13) v2(44.16,43.5) v2(44.16,42.9) v2(44.78,47.82) v2(44.77,47.18) v2(44.78,45.28) v2(44.78,44.68) v2(44.78,44.11) v2(44.78,42.74)
PHASEB: length 18.5
  Top Layer w0.254: U7.8 32.05,43.33 31.58,42.86 31.58,28.37 33.48,26.47
  vias: v2(32.23,49.96) v2(32.23,49.33) v2(32.21,48.7) v2(32.21,48.07) v2(32.21,47.42) v2(32.21,46.81) v2(32.21,46.16) v2(32.21,45.53) v2(32.19,44.9) v2(32.19,44.27) v2(32.21,42.74) v2(32.83,48.7) v2(32.83,48.07) v2(32.83,47.42) v2(33.1,45.28) v2(33.1,44.68) v2(33.1,44.11) v2(33.1,42.74) v2(33.44,48.7) v2(33.44,48.07) v2(33.44,47.42) v2(33.69,49.97) v2(33.69,49.34) v2(33.71,46.55) v2(33.71,45.91) v2(33.73,45.3) v2(33.73,44.7) v2(33.73,44.13) v2(33.73,43.5) v2(33.73,42.9) v2(34.04,48.7) v2(33.99,48.07) v2(33.99,47.43) v2(34.35,45.3) v2(34.35,44.7) v2(34.35,44.13) v2(34.35,43.5) v2(34.35,42.9) v2(34.96,49.97) v2(34.96,49.33) v2(34.93,46.55) v2(34.93,45.91) v2(34.96,45.3) v2(34.96,44.7) v2(34.96,44.13) v2(34.96,43.5) v2(34.96,42.9) v2(35.64,48.7) v2(35.56,45.3) v2(35.56,44.7) v2(35.56,44.13) v2(35.56,43.5) v2(35.56,42.9) v2(36.15,48.45) v2(36.15,47.82) v2(36.15,47.18) v2(36.21,46.55) v2(36.21,45.91) v2(36.16,45.3) v2(36.16,44.7) v2(36.16,44.13) v2(36.16,43.5) v2(36.16,42.9) v2(36.78,47.82) v2(36.77,47.18) v2(36.78,45.28) v2(36.78,44.68) v2(36.78,44.11) v2(36.78,42.74)
PHASEC: length 21.6
  Top Layer w0.254: v2(26.96,44.13) v2(27.56,44.13) 28.03,44.13 30.05,42.1 30.05,27.78 U2.19
  vias: v2(24.23,49.96) v2(24.23,49.33) v2(24.21,48.7) v2(24.21,48.07) v2(24.21,47.42) v2(24.21,46.81) v2(24.21,46.16) v2(24.21,45.53) v2(24.19,44.9) v2(24.19,44.27) v2(24.21,42.74) v2(24.83,48.7) v2(24.83,48.07) v2(24.83,47.42) v2(25.1,45.28) v2(25.1,44.68) v2(25.1,44.11) v2(25.1,42.74) v2(25.44,48.7) v2(25.44,48.07) v2(25.44,47.42) v2(25.69,49.97) v2(25.69,49.34) v2(25.71,46.55) v2(25.71,45.91) v2(25.73,45.3) v2(25.73,44.7) v2(25.73,44.13) v2(25.73,43.5) v2(25.73,42.9) v2(26.04,48.7) v2(25.99,48.07) v2(25.99,47.43) v2(26.35,45.3) v2(26.35,44.7) v2(26.35,44.13) v2(26.35,43.5) v2(26.35,42.9) v2(26.96,49.97) v2(26.96,49.33) v2(26.93,46.55) v2(26.93,45.91) v2(26.96,45.3) v2(26.96,44.7) v2(26.96,43.5) v2(26.96,42.9) v2(27.64,48.7) v2(27.56,45.3) v2(27.56,44.7) v2(27.56,43.5) v2(27.56,42.9) v2(28.15,48.45) v2(28.15,47.82) v2(28.15,47.18) v2(28.21,46.55) v2(28.21,45.91) v2(28.16,45.3) v2(28.16,44.7) v2(28.16,44.13) v2(28.16,43.5) v2(28.16,42.9) v2(28.78,47.82) v2(28.77,47.18) v2(28.78,45.28) v2(28.78,44.68) v2(28.78,44.11) v2(28.78,42.74)
PWMA: length 29.3
  Top Layer w0.254: U1.20 14.81,27.11 v2(14.69,26.99) ; U2.37 35.64,18.65 v2(35.64,17.72)
  Bottom Layer w0.254: v2(35.64,17.72) 35.39,17.46 31.58,17.46 23.2,25.84 14.69,25.84 14.43,26.1 14.43,26.73 v2(14.69,26.99)
PWMB: length 34.6
  Top Layer w0.254: U1.19 14.32,27.61 v2(14.18,27.75) ; v2(37.17,17.72) 37.17,18.54 36.18,19.53
  Bottom Layer w0.254: v2(37.17,17.72) 36.4,16.95 31.32,16.95 23.07,25.21 14.31,25.21 13.67,25.84 13.67,27.24 v2(14.18,27.75)
PWMC: length 39.8
  Top Layer w0.254: U1.18 16.43,28.11 16.03,28.51 v2(13.67,28.51) ; v2(38.56,17.72) 38.56,18.56 U2.41
  Bottom Layer w0.254: v2(13.67,28.51) 12.91,27.75 12.91,25.59 13.93,24.57 22.82,24.57 30.94,16.45 37.29,16.45 v2(38.56,17.72)
SOA: length 4.1
  Top Layer w0.254: U14.1 27.96,24.38 28.4,23.94 29.43,23.94 U2.25
SOC: length 4.4
  Top Layer w0.254: U2.23 27.96,27.04 U15.1
SPA: length 15.2
  Top Layer w0.254: U2.11 38.18,29.53 38.18,36.26 39.96,38.04 41.7,38.04 R5.2
SPC: length 17.1
  Top Layer w0.254: 31.71,24.7 29.04,27.38 29.04,37.4 27.58,38.86 26.3,38.86
SWCLK: length 26
  Top Layer w0.254: U20.4 28.66,9.46 28.15,9.97 25.86,9.97 23.83,12 21.42,12 20.28,13.14 20.28,15.56 19.01,16.83 19.01,23.3 18.62,23.69 16.97,23.69 16.86,23.8 U1.24
SWIO: length 25.1
  Top Layer w0.254: U1.23 16.34,25.61 16.08,25.36 16.08,23.56 16.47,23.18 17.99,23.18 18.5,22.67 18.5,16.57 19.77,15.3 19.77,12.89 21.16,11.49 23.7,11.49 26.12,9.08 U20.3
$1N3020: length 1.7
  Top Layer w0.254: LED1.2 22.47,35.86 R4.1
$1N3116: length 7.9
  Top Layer w0.254: C5.2 44.8,27 44.41,26.61 40.91,26.61 38.65,24.35
$1N3119: length 5.6
  Top Layer w0.254: C5.1 41.22,27.62 38.3,24.7
$1N3348: length 8.7
  Top Layer w0.254: C8.2 44.34,29.34 43.9,28.89 41.78,28.89 U2.5
$1N4267: length 3.3
  Top Layer w0.254: R8.2 22.82,20.13 22.56,19.88 22.56,18.73 22.27,18.44 LED2.1
$1N4347: length 3.6
  Top Layer w0.254: U2.29 30.9,20.13 R9.1
$1N4386: length 7.1
  Top Layer w0.254: R10.1 29.93,15.95 29.93,17.04 U2.32
$1N4470: length 5.5
  Top Layer w0.254: U2.31 28.91,16.72 R11.1
$1N4546: length 4.6
  Top Layer w0.254: R12.1 29.84,18.36 U2.30
$1N4795: length 4.5
  Top Layer w0.254: C11.2 40.97,18.28 U2.44
$1N4956: length 13.3
  Top Layer w0.254: 46.16,18.1 D1.1 ; 46.16,18.1 45.42,18.83 45.42,21.7 45.35,21.78 ; 46.16,18.1 C11.1 42.51,19.75 40.2,19.75 38.3,21.65

## Copper pours and planes (outline as drawn; the poured copper is in the pictures)
3.3V on Top Layer: 20.15,4 20.15,5.27 39.58,5.27 39.58,6.51 39.68,6.6 39.6,6.6 39.6,11.37 39.47,11.49 26.63,11.49 24.97,13.14 24.97,14.04 30.06,14.04 30.44,14.41 30.44,16.96 32.98,19.51 33.48,19 33.48,18.99 32.46,17.96 32.46,15.55 33.09,14.92 38.94,14.92 40.21,16.19 49.61,16.19 50.5,17.08 50.5,21.84 50.91,22.26 48.72,24.45 48.72,25.75 51.61,25.75 52.53,24.83 52.53,16.7 50.64,14.8 41.61,14.8 41.61,6.79 41.55,6.73 41.61,6.67 41.61,4.51 41.1,4
3.3V on Top Layer: 48.6,22.9 50.25,22.9 50.25,19.75 48.6,19.75
3.3V on Top Layer: 20.15,9.28 21.93,9.28 21.93,4.92 20.15,4.92
3.3V on Top Layer: 39.61,8.57 41.61,8.57 41.61,5.52 39.61,5.52
24V on Top Layer: 46.74,29.6 49.53,29.6 49.53,28.84 46.74,28.84
24V on Top Layer: 23.83,62.93 69.51,62.93 69.51,7.57 23.83,7.57
24V on Top Layer: 49.44,30.13 54.52,30.13 54.52,28.64 49.44,28.64
24V on Bottom Layer: 43.37,57.65 69.51,57.65 69.51,7.5 43.37,7.5
24V on Bottom Layer: 23.83,61.4 47.45,61.4 47.45,50.99 23.83,50.99
GND on Top Layer: 46.74,28.2 49.53,28.2 49.53,27.44 46.74,27.44
GND on Top Layer: 12.66,40.58 23.58,40.58 23.58,36.26 12.66,36.26
GND on Top Layer: 27.02,20.51 27.77,20.51 27.77,14.5 27.02,14.5
GND on Bottom Layer: 33.99,7.68 33.99,5.94 32.24,5.94 32.24,9.05 31.32,9.97 24.59,9.97 24.47,10.1 24.47,7.59 22.68,7.59 22.68,9.99 12.75,9.99 11,8.25 11,8.15 10.95,8.19 10.9,8.15 10.9,8.24 3.24,19.49 0.51,32.83 3.21,46.22 10.9,57.51 11.47,57.93 12.27,57.93 12.27,40.58 23.45,40.58 23.45,33.34 21.04,30.92 15.07,30.92 15.07,23.3 22.56,23.3 30.56,15.3 36.53,15.3 36.53,10.22
GND on Bottom Layer: 42.95,26.86 50.63,26.86 50.63,23.76 42.95,23.76
GND on Bottom Layer: 15.41,31.62 45.8,31.62 45.8,17.84 15.41,17.84
GND on Bottom Layer: 32.21,8.52 33.99,8.52 33.99,5.89 32.21,5.89
GND on Bottom Layer: 22.68,9.37 24.47,9.37 24.47,6.75 22.68,6.75
BAT- on Top Layer: 21.39,45.91 23.45,45.91 23.45,42.17 21.39,42.17
BAT- on Top Layer: 32.72,41.21 35.9,41.21 35.9,36.13 32.72,36.13
BAT- on Top Layer: 42.5,26.61 57.49,26.61 57.49,11.24 42.5,11.24
BAT- on Top Layer: 40.72,51.63 57.49,51.63 57.49,28.13 40.72,28.13
BAT- on Top Layer: 24.59,37.06 27.94,37.06 27.94,33.59 24.59,33.59
BAT- on Bottom Layer: 21.42,62.93 57.49,62.93 57.49,11.24 21.42,11.24
FB on Top Layer: 40.2,24.96 42.54,24.96 42.54,22.68 40.2,22.68
LP_SOA on Top Layer: 24.34,25.59 27.01,25.59 27.01,24.58 24.34,24.58
LP_SOC on Top Layer: 24.34,27.62 27.01,27.62 27.01,26.61 24.34,26.61
PHASEA on Top Layer: 39.88,50.26 45.14,50.26 45.14,42.35 39.88,42.35
PHASEA on Bottom Layer: 39.88,50.39 45.15,50.39 45.15,42.35 39.88,42.35
PHASEB on Top Layer: 31.88,50.26 37.14,50.26 37.14,42.35 31.88,42.35
PHASEB on Bottom Layer: 31.88,50.39 37.15,50.39 37.15,42.35 31.88,42.35
PHASEC on Top Layer: 23.88,50.39 29.15,50.39 29.15,42.35 23.88,42.35
PHASEC on Bottom Layer: 23.88,50.39 29.15,50.39 29.15,42.35 23.88,42.35
SPA on Top Layer: 40.74,41.22 43.91,41.22 43.91,39.06 40.74,39.06
SPC on Top Layer: 24.73,41.23 27.92,41.23 27.92,39.05 24.73,39.05
$1N4956 on Top Layer: 43.41,21.71 46.69,21.71 46.69,17.21 43.41,17.21

Small or netless copper shapes (teardrops, artwork), in the pictures only: 2 on Top Layer

## Text on the board
Top Silkscreen Layer: 3.3V | GND | SWIO | SWCLK | MAG_ENC | ENCB | ENCA | H | L | BAT+ | BAT-
